# EAGLE board electrobassrev8_fix (EAGLE 9.6.2), part 1 of 2
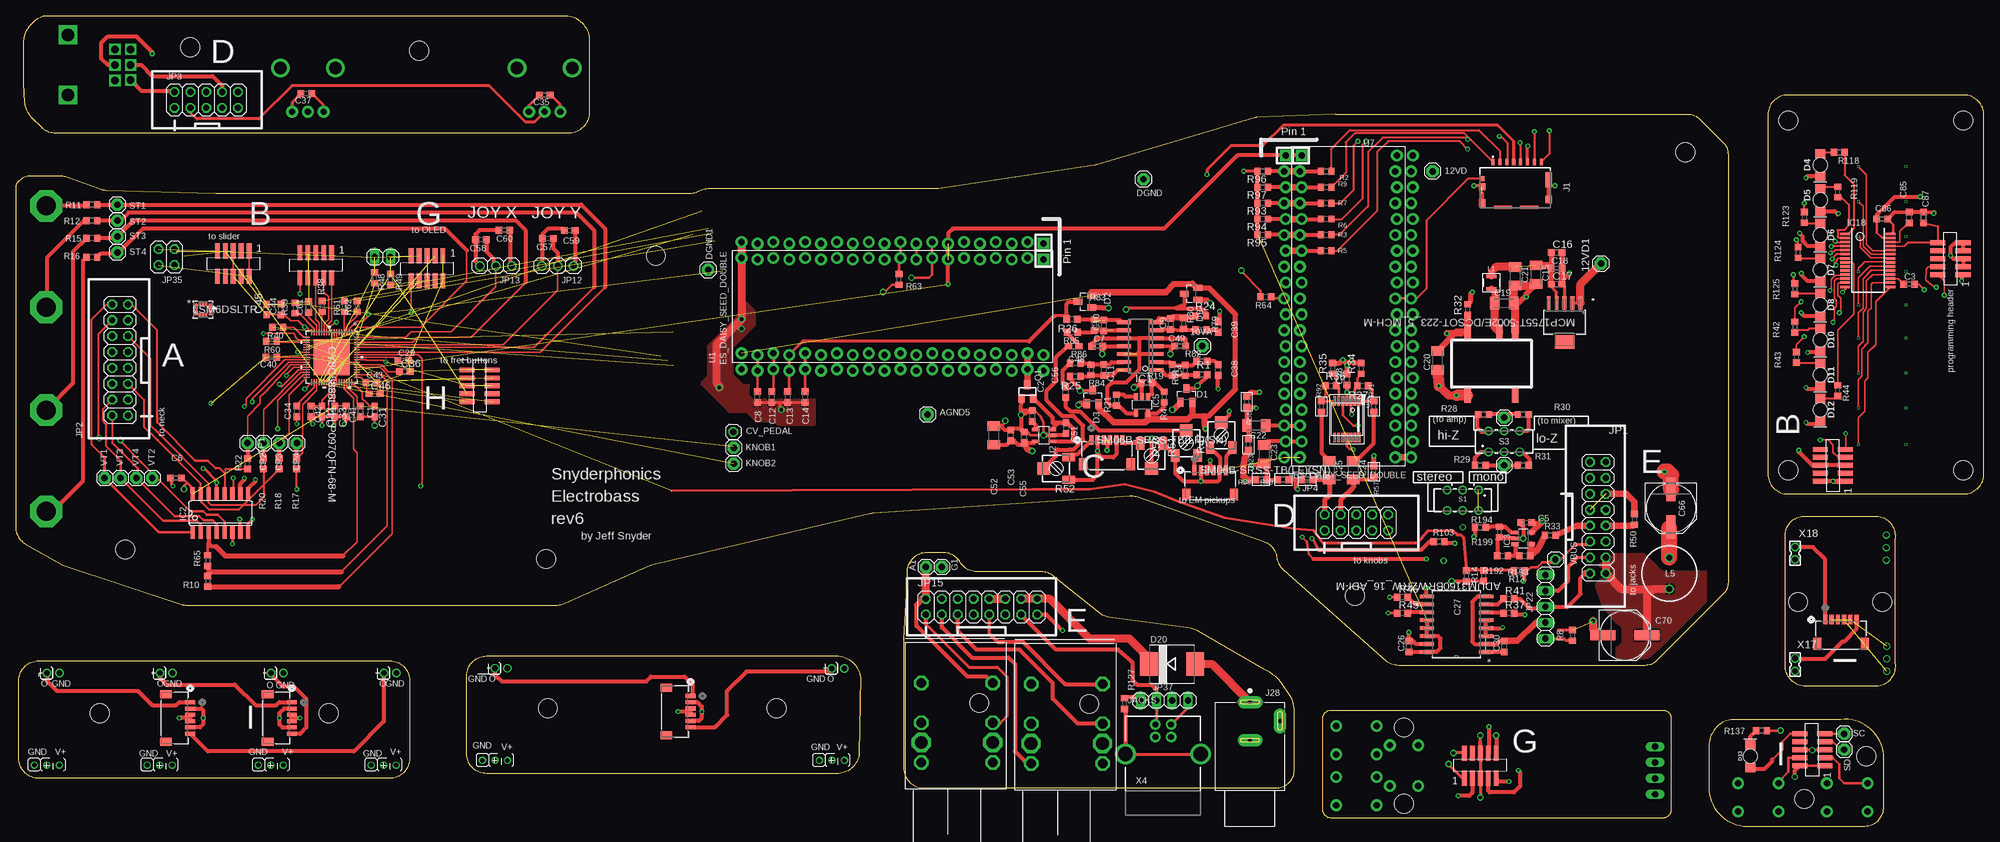
[diagram p11: board, top side]
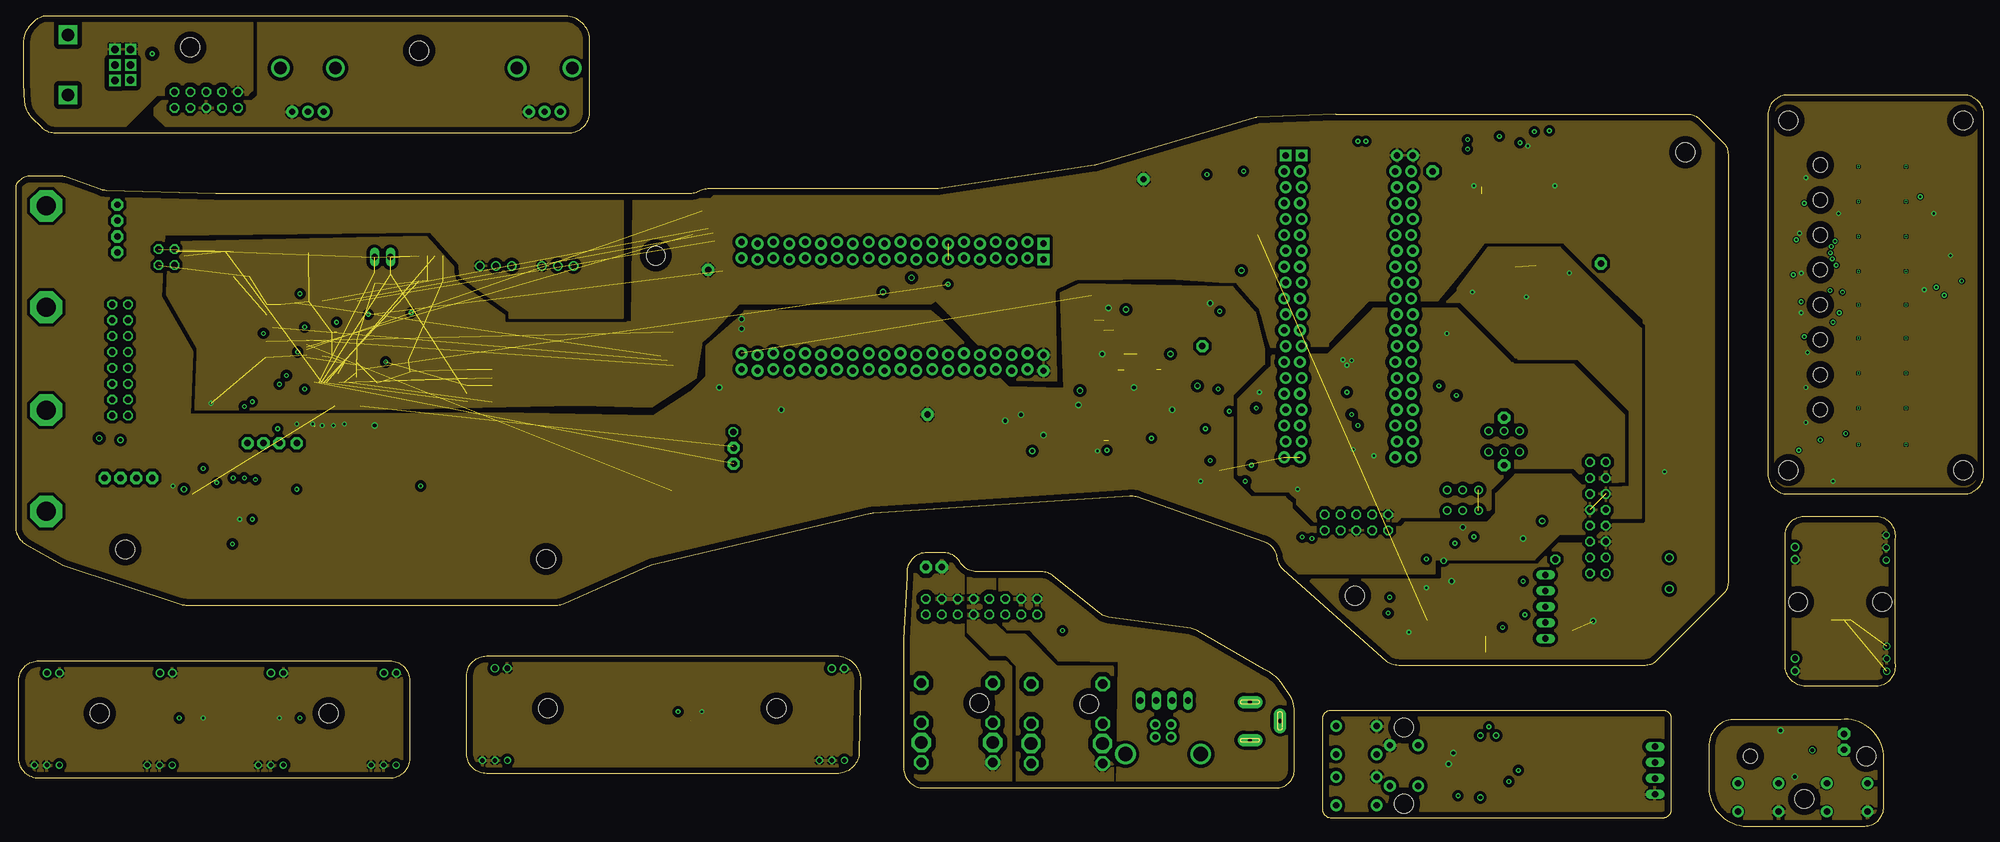
[diagram p12: board, inner layer Route2]
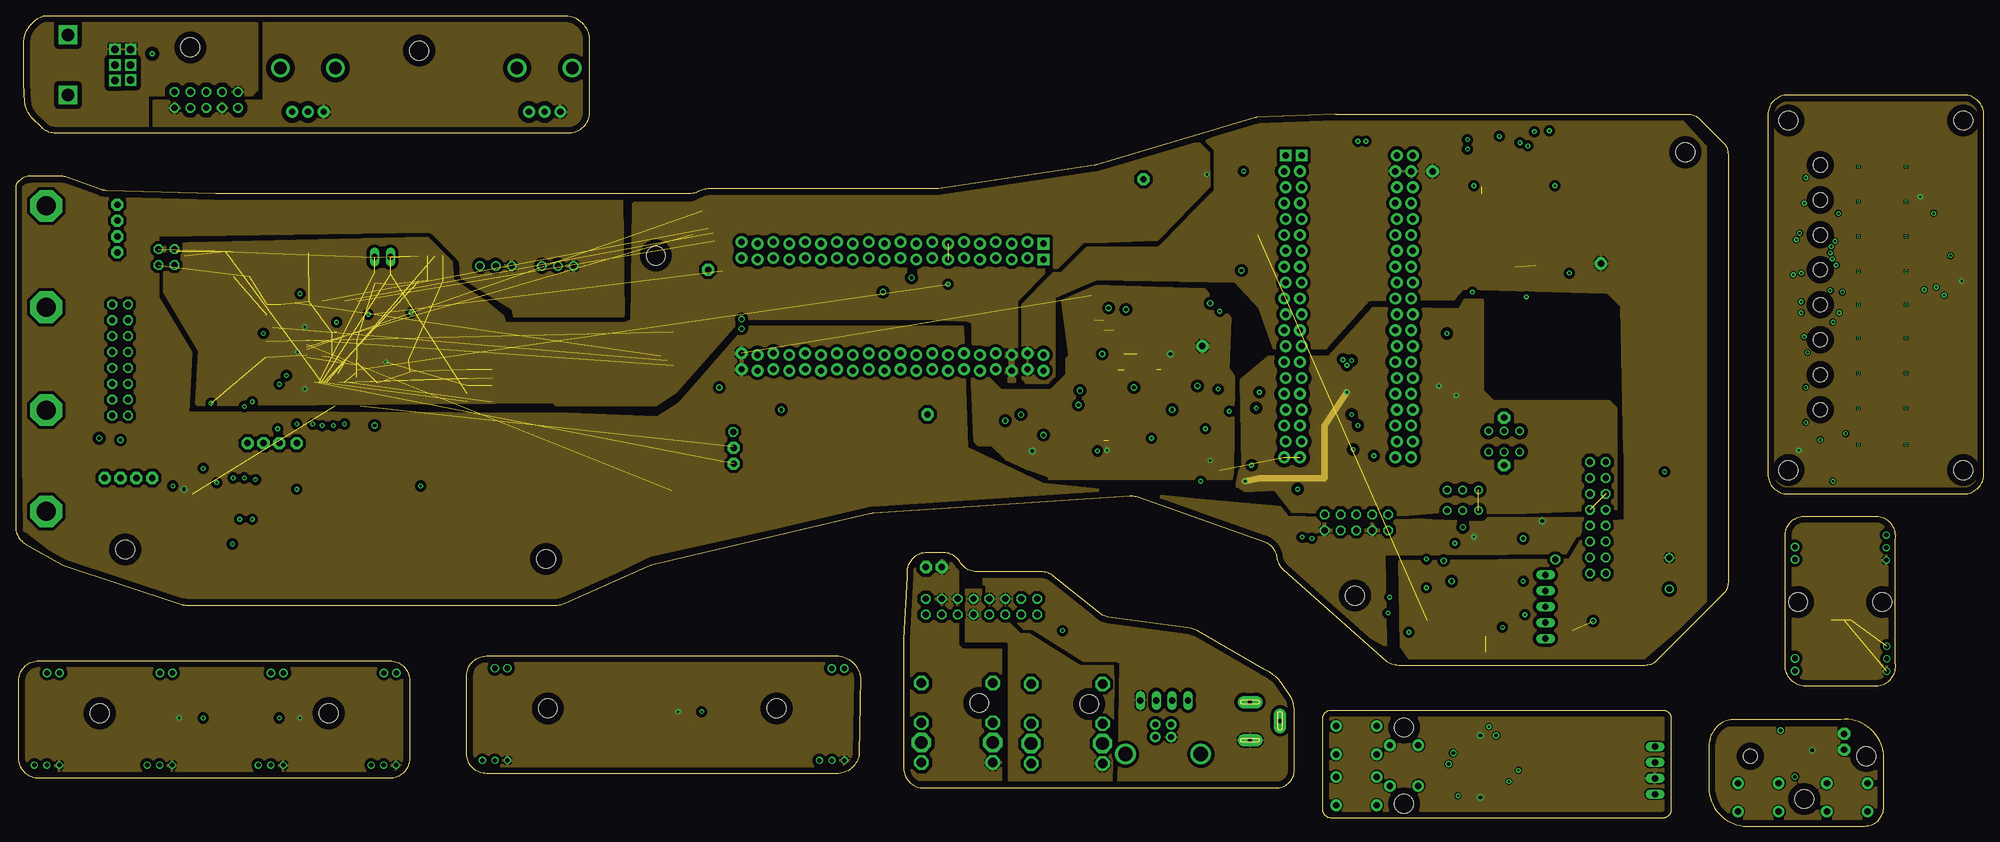
[diagram p13: board, inner layer Route15]
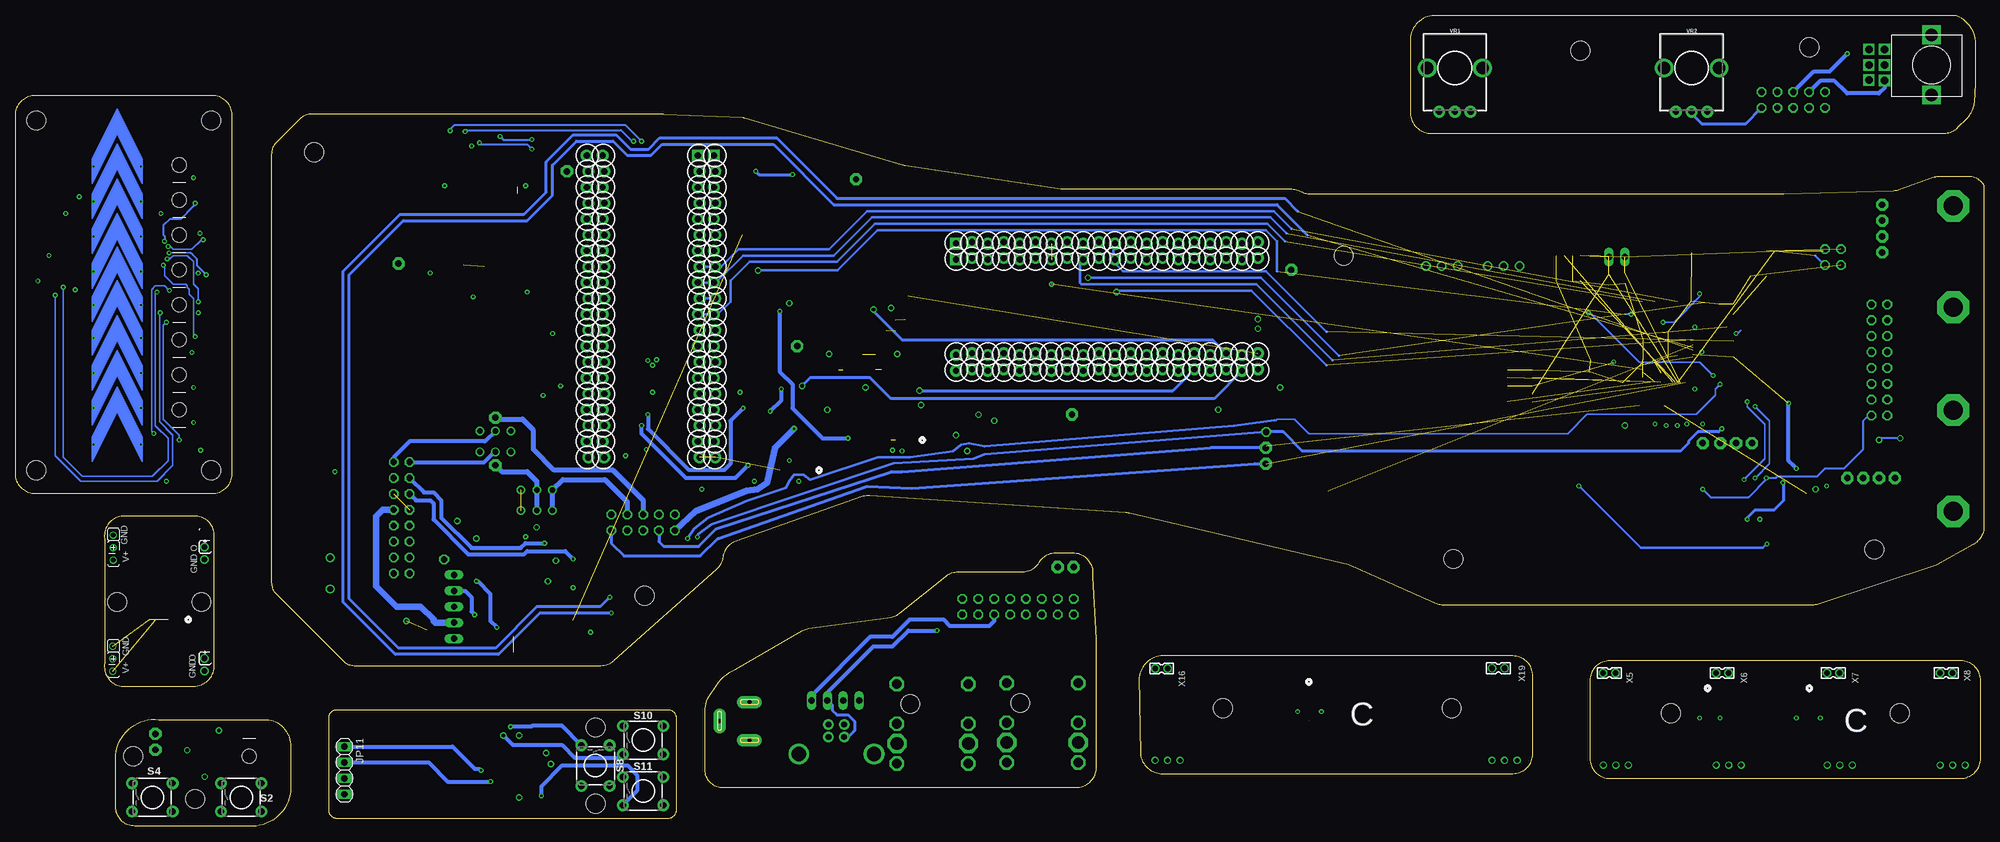
[diagram p14: board, bottom side, seen from below]

Size 314.71 x 129.54 mm. Coordinates in mm from the lower left corner, seen from the top.
Outline: 0,102.36 0,47.82 arc60 1.61,45.06 7.62,41.66 26.44,35.46 arc18 27.43,35.31 86.45,35.31 arc24 87.74,35.58 101.07,41.53 arc-11 101.64,41.73 136.64,49.98 arc-10 137.18,50.05 178.16,52.79 arc-23 179.43,52.62 199.52,45.54 arc-58 201.56,43.26 201.7,42.64 arc35 202.69,40.98 219.06,26.45 arc42 221.17,25.65 260.57,25.65 arc45 262.36,26.4 273.07,37.1 arc45 273.81,38.9 273.81,107.41 arc45 273.07,109.2 269.22,113.05 arc45 267.43,113.79 211.07,113.79 198.37,113.28 arc-9 198.13,113.21 172.93,105.73 arc-8 172.5,105.63 147.55,101.89 arc-9 147.08,101.85 110.89,101.85 arc23 109.64,101.6 109.06,101.35 arc-23 107.81,101.09 32,101.09 14.48,101.59 arc-18 13.49,101.77 8.14,103.7 arc20 7.07,103.89 2.47,103.89 arc63 0,102.36
Outline: 311.53,116.84 283.34,116.84 arc90 280.16,113.66 280.16,56.26 arc90 283.34,53.09 311.53,53.09 arc90 314.71,56.26 314.71,113.66 arc90 311.53,116.84
Outline: 291.85,17.02 275,17.02 arc90 270.76,13.03 270.76,6.78 arc90 276.27,0 295.66,0 arc90 298.7,3.05 298.7,11.43 arc90 291.85,17.02
Outline: 4.62,129.52 88.27,129.54 arc-90 91.69,125.09 91.69,113.92 arc-90 88.27,110.74 6.39,110.74 arc-45 4.15,111.67 2.65,113.17 arc-18 2.06,114 1.81,114.5 arc-22 1.48,115.69 1.27,118.62 1.27,125.03 arc-70 4.38,129.49 4.53,129.53 arc-20 4.62,129.52
Outline: 210.31,18.54 263.4,18.54 arc-90 264.67,17.27 264.67,2.54 arc-90 263.4,1.27 210.31,1.27 arc-90 209.04,2.54 209.04,17.27 arc-90 210.31,18.54
Outline: 142.49,39.88 141.99,29.97 141.99,9.27 arc90 145.16,6.1 201.8,6.1 arc90 204.47,9.27 204.47,18.27 arc28 203.85,20.76 202.63,22.52 arc34 199.56,25.1 188.98,31.21 arc21 187.89,31.57 175.26,33.27 174.75,33.38 arc-27 173.39,34.01 165.97,39.94 arc39 163.99,40.64 153.72,40.64 arc-60 150.97,42.22 arc60 148.41,43.69 145.67,43.69 arc90 142.49,40.51 142.49,39.88
Outline: 130.94,8.38 75.31,8.38 arc-90 72.14,11.56 72.14,24 arc-90 75.31,27.18 130.43,27.18 arc-90 135.13,23.75 134.87,11.56 arc-90 130.94,8.38
Outline: 282.96,26.03 282.96,46.36 arc-90 285.88,49.53 297.81,49.53 arc-90 300.48,45.85 300.48,26.03 arc-90 297.81,22.35 285.88,22.35 arc-90 282.96,26.03
Outline: 59.82,7.62 3.68,7.62 arc-90 0.51,10.79 0.51,23.24 arc-90 3.68,26.42 59.82,26.42 arc-90 62.99,23.24 62.99,10.79 arc-90 59.82,7.62
Copper layers (1+2*15+16): Top 0.035mm / dielectric 1.5mm / Route2 0.035mm / dielectric 0.15mm / Route15 0.035mm / dielectric 0.2mm / Bottom 0.035mm
Design rules "default *": minimum track width 8mil, minimum drill 12mil, track to track 7mil, track to pad 7mil, pad to pad 7mil, via to via 7mil, smd to smd 7mil, copper to edge 40mil, drill to drill 8mil, minimum pad ring 1mil, minimum via ring 8mil, stop-mask expansion 1mil, vias tented up to drill 0mil, thermal gap 10mil
Holes 3.05 mm at 84.84,42.67 17.53,44.2 102.36,91.19 214.12,36.83 266.95,107.7 311.4,112.78 311.4,56.9 283.46,56.9 283.46,112.78 286,4.32 295.91,11.18 64.52,123.95 27.94,124.46 222,15.75 222,3.56 85.09,18.8 121.67,18.8 298.45,35.81 284.99,35.81 13.46,18.03 50.04,18.03

## Footprints (pad centres in the part's own frame; a part is rotated, then mirrored left to right if it is on the bottom)
1X01 = drill 1.016 pad 1.93 octagon: 1 0,0
C0603K = smd 1.05 x 1.08: 1 -0.875,0; 2 0.875,0
C1206K = smd 1.5 x 2: 1 -1.5,0; 2 1.5,0
C0603 = smd 1.1 x 1: 1 -0.85,0; 2 0.85,0
PANASONIC_E = smd 3.8 x 1.4: + 3,0; - -3,0
PANASONIC_F = smd 4 x 1.6: + 3.55,0; - -3.55,0
1X01' = drill 1.016 octagon: 1 0,0
SOT23 = smd 1 x 1.4: 1 -0.95,-1.1; 2 0.95,-1.1; 3 0,1.1
LED-1206-BOTTOM = smd 1.5 x 1.6: A -1.8,0; C 1.8,0 | hole 2.3: 0,0
SMC = smd 2.8 x 3.8: A 3.7,0; C -3.7,0
SO14 = smd 0.6 x 2.2: 1 -3.81,-2.6; 2 -2.54,-2.6; 3 -1.27,-2.6; 4 0,-2.6; 5 1.27,-2.6; 6 2.54,-2.6; 7 3.81,-2.6; 8 3.81,2.6; 9 2.54,2.6; 10 1.27,2.6; 11 0,2.6; 12 -1.27,2.6; 13 -2.54,2.6; 14 -3.81,2.6
SO16 = smd 0.66 x 2.032: 1 -4.445,-3.073; 2 -3.175,-3.073; 3 -1.905,-3.073; 4 -0.635,-3.073; 5 0.635,-3.073; 6 1.905,-3.073; 7 3.175,-3.073; 8 4.445,-3.073; 9 4.445,3.073; 10 3.175,3.073; 11 1.905,3.073; 12 0.635,3.073; 13 -0.635,3.073; 14 -1.905,3.073; 15 -3.175,3.073; 16 -4.445,3.073
SOT23-5 = smd 0.6 x 1.2: 1 -0.95,-1.306; 2 0,-1.306; 3 0.95,-1.306; 4 0.95,1.306; 5 -0.95,1.306
SSOP28 = smd 0.4 x 1.5: 1 -4.225,-3.625; 2 -3.575,-3.625; 3 -2.925,-3.625; 4 -2.275,-3.625; 5 -1.625,-3.625; 6 -0.975,-3.625; 7 -0.325,-3.625; 8 0.325,-3.625; 9 0.975,-3.625; 10 1.625,-3.625; 11 2.275,-3.625; 12 2.925,-3.625; 13 3.575,-3.625; 14 4.225,-3.625; 15 4.225,3.625; 16 3.575,3.625; 17 2.925,3.625; 18 2.275,3.625; 19 1.625,3.625; 20 0.975,3.625; 21 0.325,3.625; 22 -0.325,3.625; 23 -0.975,3.625; 24 -1.625,3.625; 25 -2.275,3.625; 26 -2.925,3.625; 27 -3.575,3.625; 28 -4.225,3.625
105162-0001 = smd 0.5 x 1: 1 3.55,-7.34; 2 2.45,-7.34; 3 1.35,-7.34; 4 0.25,-7.34; 5 -0.85,-7.34; 6 -1.95,-7.34; 7 -3.05,-7.34; 8 -4.15,-7.34 | smd 0.72 x 0.78: 9 5.31,-4.66 | smd 1.05 x 1.08: 10 5.325,-3.39 | smd 1.05 x 1.2: 11 5.325,-0.78; 12 -5.325,-1.35 | smd 1.05 x 2.39: 13 -5.325,-4.535 | smd 2.91 x 0.55: 14 1.986,-0.105; 15 -2.204,-0.105
CONN_SM06B-SRSS-TB_JST = smd 0.66 x 1.549: 1 -2.5,2.507; 2 -1.5,2.507; 3 -0.5,2.507; 4 0.5,2.507; 5 1.5,2.507; 6 2.5,2.507 | smd 1.295 x 1.905: 7 -3.8,-1.368; 8 3.8,-1.368
CUI_PJ-066A = drill 0.7 pad 2 long: 1 0,0; 2 6.1,0; 3 3,4.8
2X08 = drill 1.016 octagon: 1 -8.89,-1.27; 2 -8.89,1.27; 3 -6.35,-1.27; 4 -6.35,1.27; 5 -3.81,-1.27; 6 -3.81,1.27; 7 -1.27,-1.27; 8 -1.27,1.27; 9 1.27,-1.27; 10 1.27,1.27; 11 3.81,-1.27; 12 3.81,1.27; 13 6.35,-1.27; 14 6.35,1.27; 15 8.89,-1.27; 16 8.89,1.27
2X05 = drill 1.016 octagon: 1 -5.08,-1.27; 2 -5.08,1.27; 3 -2.54,-1.27; 4 -2.54,1.27; 5 0,-1.27; 6 0,1.27; 7 2.54,-1.27; 8 2.54,1.27; 9 5.08,-1.27; 10 5.08,1.27
20021121 = smd 0.76 x 2.4: 1 -2.54,-2; 2 -2.54,2; 3 -1.27,-2; 4 -1.27,2; 5 0,-2; 6 0,2; 7 1.27,-2; 8 1.27,2; 9 2.54,-2; 10 2.54,2
1X04 = drill 1.016 long: 1 -3.81,0; 2 -1.27,0; 3 1.27,0; 4 3.81,0
1X03 = drill 1.016: 1 -2.54,0; 2 0,0; 3 2.54,0
1X05 = drill 1.016 long: 1 -5.08,0; 2 -2.54,0; 3 0,0; 4 2.54,0; 5 5.08,0
1X02 = drill 1.016 long: 1 -1.27,0; 2 1.27,0
2X02 = drill 1.016 octagon: 1 -1.27,-1.27; 2 -1.27,1.27; 3 1.27,-1.27; 4 1.27,1.27
BOURNS_SRP2010 = smd 0.559 x 1.6: P$1 -1.003,0; P$2 1.003,0
6000-XXXX-RC = drill 0.9 pad 1.422: 1 -2.5,0; 2 2.5,0
SUPER-SOT3 = smd 1 x 1.4: 1 -0.95,-1.1; 2 0.95,-1.1; 3 0,1.1
R0603 = smd 1 x 1.1: 1 -0.85,0; 2 0.85,0
RTRIM3314J = smd 1.3 x 2: 1 1.8,-2; 3 -1.8,-2 | smd 2 x 2: 2 0,2
452404020202 = drill 0.9: 1 2.5,1.65; 2 0,1.65; 3 -2.5,1.65; 4 2.5,-1.65; 5 0,-1.65; 6 -2.5,-1.65
TACTILE_SWITCH_PTH_6.0MM = drill 1.016 pad 1.88: 1 -3.251,2.261; 2 3.251,2.261; 3 -3.251,-2.261; 4 3.251,-2.261
ES_DAISY_SEED_DOUBLE = drill 1.016 pad 1.88 square: 1 -7.493,24.13; B1 -10.033,24.13 | drill 1.016 pad 1.88: 2 -7.747,21.59; 3 -7.493,19.05; 4 -7.747,16.51; 5 -7.493,13.97; 6 -7.747,11.43; 7 -7.493,8.89; 8 -7.747,6.35; 9 -7.493,3.81; 10 -7.747,1.27; 11 -7.493,-1.27; 12 -7.747,-3.81; 13 -7.493,-6.35; 14 -7.747,-8.89; 15 -7.493,-11.43; 16 -7.747,-13.97; 17 -7.493,-16.51; 18 -7.747,-19.05; 19 -7.493,-21.59; 20 -7.747,-24.13; 21 7.493,-24.13; 22 7.747,-21.59; 23 7.493,-19.05; 24 7.747,-16.51; 25 7.493,-13.97; 26 7.747,-11.43; 27 7.493,-8.89; 28 7.747,-6.35; 29 7.493,-3.81; 30 7.747,-1.27; 31 7.493,1.27; 32 7.747,3.81; 33 7.493,6.35; 34 7.747,8.89; 35 7.493,11.43; 36 7.747,13.97; 37 7.493,16.51; 38 7.747,19.05; 39 7.493,21.59; 40 7.747,24.13; B2 -10.287,21.59; B3 -10.033,19.05; B4 -10.287,16.51; B5 -10.033,13.97; B6 -10.287,11.43; B7 -10.033,8.89; B8 -10.287,6.35; B9 -10.033,3.81; B10 -10.287,1.27; B11 -10.033,-1.27; B12 -10.287,-3.81; B13 -10.033,-6.35; B14 -10.287,-8.89; B15 -10.033,-11.43; B16 -10.287,-13.97; B17 -10.033,-16.51; B18 -10.287,-19.05; B19 -10.033,-21.59; B20 -10.287,-24.13; B21 10.033,-24.13; B22 10.287,-21.59; B23 10.033,-19.05; B24 10.287,-16.51; B25 10.033,-13.97; B26 10.287,-11.43; B27 10.033,-8.89; B28 10.287,-6.35; B29 10.033,-3.81; B30 10.287,-1.27; B31 10.033,1.27; B32 10.287,3.81; B33 10.033,6.35; B34 10.287,8.89; B35 10.033,11.43; B36 10.287,13.97; B37 10.033,16.51; B38 10.287,19.05; B39 10.033,21.59; B40 10.287,24.13
SOT25 = smd 0.55 x 1.2: 1 -0.95,-1.3; 2 0,-1.3; 3 0.95,-1.3; 4 0.95,1.3; 5 -0.95,1.3
SOT-223_5_MCH-M = smd 0.61 x 2.159: 1 -2.54,-3.109; 2 -1.27,-3.109; 3 0,-3.109; 4 1.27,-3.109; 5 2.54,-3.109 | smd 3.15 x 2.159: 6 0,3.109
QFN-68-M = smd 0.914 x 0.203: 1 -4,3.2; 2 -4,2.8; 3 -4,2.4; 4 -4,2; 5 -4,1.6; 6 -4,1.2; 7 -4,0.8; 8 -4,0.4; 9 -4,0; 10 -4,-0.4; 11 -4,-0.8; 12 -4,-1.2; 13 -4,-1.6; 14 -4,-2; 15 -4,-2.4; 16 -4,-2.8; 17 -4,-3.2; 35 4,-3.2; 36 4,-2.8; 37 4,-2.4; 38 4,-2; 39 4,-1.6; 40 4,-1.2; 41 4,-0.8; 42 4,-0.4; 43 4,0; 44 4,0.4; 45 4,0.8; 46 4,1.2; 47 4,1.6; 48 4,2; 49 4,2.4; 50 4,2.8; 51 4,3.2 | smd 0.203 x 0.914: 18 -3.2,-4; 19 -2.8,-4; 20 -2.4,-4; 21 -2,-4; 22 -1.6,-4; 23 -1.2,-4; 24 -0.8,-4; 25 -0.4,-4; 26 0,-4; 27 0.4,-4; 28 0.8,-4; 29 1.2,-4; 30 1.6,-4; 31 2,-4; 32 2.4,-4; 33 2.8,-4; 34 3.2,-4; 52 3.2,4; 53 2.8,4; 54 2.4,4; 55 2,4; 56 1.6,4; 57 1.2,4; 58 0.8,4; 59 0.4,4; 60 0,4; 61 -0.4,4; 62 -0.8,4; 63 -1.2,4; 64 -1.6,4; 65 -2,4; 66 -2.4,4; 67 -2.8,4; 68 -3.2,4 | smd 5.791 x 5.791: 69 0,0
RW_16_ADI-M = smd 2.286 x 0.559: 1 -4.737,4.445; 2 -4.737,3.175; 3 -4.737,1.905; 4 -4.737,0.635; 5 -4.737,-0.635; 6 -4.737,-1.905; 7 -4.737,-3.175; 8 -4.737,-4.445; 9 4.737,-4.445; 10 4.737,-3.175; 11 4.737,-1.905; 12 4.737,-0.635; 13 4.737,0.635; 14 4.737,1.905; 15 4.737,3.175; 16 4.737,4.445
QFN_6DSLTR_STM = smd 0.584 x 0.356: 1 -1.156,0.75; 2 -1.156,0.25; 3 -1.156,-0.25; 4 -1.156,-0.75; 8 1.156,-0.75; 9 1.156,-0.25; 10 1.156,0.25; 11 1.156,0.75 | smd 0.356 x 0.584: 5 -0.5,-0.914; 6 0,-0.914; 7 0.5,-0.914; 12 0.5,0.914; 13 0,0.914; 14 -0.5,0.914
TSSOP-14 = smd 0.45 x 1.5: 1 -1.95,-2.9; 2 -1.3,-2.9; 3 -0.65,-2.9; 4 0,-2.9; 5 0.65,-2.9; 6 1.3,-2.9; 7 1.95,-2.9; 8 1.95,2.9; 9 1.3,2.9; 10 0.65,2.9; 11 0,2.9; 12 -0.65,2.9; 13 -1.3,2.9; 14 -1.95,2.9
SLIDERS_SLIDER-SEGMENT3 = drill 0.254 pad 0.406 square: P$1 -1.27,3.81; P$2 -1.27,-3.81
PN092 = drill 2 square: P$1 -4.8,0; P$2 4.8,0 | drill 1.2 square: P$3 -2.5,-7.5; P$4 0,-7.5; P$5 2.5,-7.5; P$6 -2.5,-10; P$7 0,-10; P$8 2.4,-10
XP_POWER_ISEXXXXA = smd 1 x 2.28: P$1 -3.81,-5.08; P$2 -1.27,-5.08; P$4 3.81,-5.08; P$5 3.81,5.08; P$8 -3.81,5.08
STRING_HOLDER = drill 3.048 pad 5.08 octagon: P$1 0,0
POT-PTH-ALPS-KIT = drill 1 pad 1.88: P$1 7,-2.5; P$2 7,0; P$3 7,2.5 | drill 2: P$4 0,-4.4; P$5 0,4.4
3P-2MM-TH = drill 0.75: P$1 -2,0; P$2 0,0; P$3 2,0
NRJ6HF2 = drill 2.057 octagon: POST1 -7.442,0; POST2 -7.442,-11.43 | drill 1.524 octagon: R -10.6,0; RN -10.6,-11.43; S -4.25,0; SN -4.25,-11.43; T -16.942,0; TN -16.942,-11.43 | hole 2.997: -13.792,-2.134
USB-B-PTH = drill 0.914 pad 1.676: D+ 0,1.25; D- 1.981,1.25; GND 0,-1.25; VBUS 1.981,-1.25 | drill 2.286: S1 -2.718,-6.02; S2 -2.718,6.02
332-02 = drill 0.9 pad 1.27: 1 0,-1; 2 0,1

## Placement (x,y rotation side)
10VA  [1X01]  189.74,76.71 90 top
12VD  [1X01]  226.57,104.65 270 top
12VD1  [1X01]  253.49,89.92 90 top
A1  [1X01]  145.54,41.4 0 top
AGND5  [1X01]  145.8,65.79 0 top
AUDIO_OUT_L_POSTVOL  [1X01]  238,65.28 0 top
AUDIO_OUT_R_POSTVOL  [1X01]  238,57.66 0 top
C1  .01uf  [C0603K]  55.12,66.29 270 top
C2  .01uf  [C0603K]  162.56,65.53 90 top
C3  2200pf  [C0603K]  302.77,86.61 0 top
C4  560pf  [C0603K]  184.91,72.9 270 top
C5  .1uf  [C0603K]  241.55,48.51 180 top
C6  .1uf  [C0603K]  25.65,55.63 180 top
C7  .1uf  [C0603K]  172.97,76.71 0 top
C8  .01uf  [C0603K]  118.62,68.58 270 top
C9  560pf  [C0603K]  184.66,80.26 90 top
C10  560pf  [C0603K]  173.99,80.01 90 top
C11  560pf  [C0603K]  173.99,72.9 270 top
C12  .01uf  [C0603K]  120.9,68.58 270 top
C13  .01uf  [C0603K]  123.44,68.58 270 top
C14  .01uf  [C0603K]  126.24,68.58 270 top
C15  10uf  [C1206K]  243.08,88.14 270 top
C16  1uf  [C0603]  246.38,91.69 0 top
C17  .001uf  [C0603]  246.38,86.61 0 top
C18  .01uf  [C0603K]  246.38,89.15 0 top
C19  10uf  [C1206K]  238,83.57 0 top
C20  10uf  [C1206K]  227.33,74.42 90 top
C21  10uf  [C1206K]  239.78,87.88 270 top
C22  10uf  [C1206K]  198.37,64.01 180 top
C23  10uf  [C1206K]  199.64,59.44 270 top
C24  10uf  [C1206K]  213.87,56.9 270 top
C25  10uf  [C1206K]  210.06,56.9 270 top
C26  .1uf  [C0603K]  222.76,28.7 90 top
C27  .1uf  [C0603K]  231.96,39.99 270 top
C28  .1uf  [C0603K]  212.85,71.37 90 top
C29  2200pf  [C0603K]  61.98,74.42 0 top
C30  .1uf  [C0603K]  238,28.7 90 top
C31  1uf  [C0603]  57.4,66.29 270 top
C32  1uf  [C0603]  49.02,66.29 270 top
C33  1uf  [C0603]  51.05,66.29 270 top
C34  .01uf  [C0603K]  44.96,66.29 270 top
C35  .1uf  [C0603K]  84.58,116.84 180 top
C36  1uf  [C0603]  62.23,72.64 0 top
C37  .1uf  [C0603K]  46.48,117.09 180 top
C38  1uf  [C0603]  192.28,72.9 90 top
C39  1uf  [C0603]  192.28,79.76 270 top
C40  .1uf  [C0603K]  40.89,74.93 180 top
C41  .1uf  [C0603K]  52.83,66.29 270 top
C42  .1uf  [C0603K]  47.24,66.29 270 top
C43  .1uf  [C0603K]  56.9,70.87 0 top
C44  .1uf  [C0603K]  42.42,82.55 90 top
C45  1uf  [C0603]  40.13,82.55 90 top
C46  1uf  [C0603]  57.4,69.09 0 top
C48  1uf  [C0603]  169.16,76.71 0 top
C49  .1uf  [C0603K]  186.21,76.74 0 top
C51  1uf  [C0603]  167.93,63.6 270 top
C52  10uf  [C1206K]  156.37,62.45 90 top
C53  1uf  [C0603]  159.1,62.45 90 top
C55  .001uf  [C0603]  161.26,62.13 90 top
C56  1uf  [C0603]  167.89,69.34 90 top
C57  .01uf  [C0603K]  85.09,93.92 180 top
C58  .01uf  [C0603K]  74.42,93.73 180 top
C59  .1uf  [C0603K]  88.58,95.19 180 top
C60  .1uf  [C0603K]  78.17,95.25 180 top
C61  2200pf  [C0603K]  46.84,82.98 90 top
C66  47uf  [PANASONIC_E]  264.67,50.8 270 top
C70  100uf  [PANASONIC_F]  257.3,30.48 0 top
C85  .1uf  [C0603K]  302.77,97.28 90 top
C86  .1uf  [C0603K]  298.45,97.03 0 top
C87  .1uf  [C0603K]  305.05,97.28 90 top
CP1  [1X01]  37.08,61.21 0 top
CP2  [1X01]  39.62,61.21 0 top
CP3  [1X01]  42.16,61.21 0 top
CP4  [1X01]  44.96,61.21 0 top
CV_PEDAL  [1X01']  114.74,62.99 0 top
D1  BAT54S  [SOT23]  187.2,68.83 0 top
D2  BAT54S  [SOT23]  170.94,83.82 90 top
D3  BAT54S  [SOT23]  172.21,68.58 0 top
D4  [LED-1206-BOTTOM]  288.54,105.66 270 top
D5  [LED-1206-BOTTOM]  288.54,100.08 270 top
D6  [LED-1206-BOTTOM]  288.54,94.49 270 top
D7  [LED-1206-BOTTOM]  288.54,88.9 270 top
D8  [LED-1206-BOTTOM]  288.54,83.31 270 top
D9  BAT54S  [SOT23]  187.96,85.09 90 top
D10  [LED-1206-BOTTOM]  288.54,77.72 270 top
D11  [LED-1206-BOTTOM]  288.54,72.14 270 top
D12  [LED-1206-BOTTOM]  288.54,66.55 270 top
D13  [LED-1206-BOTTOM]  277.37,11.18 90 top
D20  MBRS340T3  [SMC]  184.91,25.91 0 top
DGND  [1X01]  180.34,103.38 270 top
DGND1  [1X01]  110.74,88.9 90 top
G1  [1X01]  148.08,41.4 0 top
IC1  LMV324M  [SO14]  179.83,76.71 90 top
IC2  4052D  [SO16]  32.77,50.04 0 top
IC3  LMV321M5  [SOT23-5]  241.05,45.97 270 top
IC5  LMV321M5  [SOT23-5]  180.09,67.31 180 top
IC18  CY8C4124  [SSOP28]  296.16,90.42 270 top
J1  105162-0001  [105162-0001]  239.78,98.81 180 top
J2  SM06B-SRSS-TB(LF)(SN)  [CONN_SM06B-SRSS-TB_JST]  174.5,59.18 0 top
J3  SM06B-SRSS-TB(LF)(SN)  [CONN_SM06B-SRSS-TB_JST]  191.01,54.36 0 top
J5  SM06B-SRSS-TB(LF)(SN)  [CONN_SM06B-SRSS-TB_JST]  291.85,30.48 0 top
J6  SM06B-SRSS-TB(LF)(SN)  [CONN_SM06B-SRSS-TB_JST]  105.41,18.29 270 top
J7  SM06B-SRSS-TB(LF)(SN)  [CONN_SM06B-SRSS-TB_JST]  25.4,17.27 270 top
J8  SM06B-SRSS-TB(LF)(SN)  [CONN_SM06B-SRSS-TB_JST]  41.66,17.27 270 top
J28  PJ-066A  [CUI_PJ-066A]  197.36,19.81 270 top
JP1  [2X08]  252.98,49.28 270 top
JP2  [2X08]  16.71,74.5 90 top
JP3  PINHD-2X5  [2X05]  30.48,116.08 0 top
JP4  PINHD-2X5  [2X05]  214.38,48.51 0 top
JP5  20021121  [20021121]  48.01,89.66 180 top
JP6  20021121  [20021121]  290.58,57.66 90 top
JP8  20021121  [20021121]  34.8,89.92 180 top
JP9  20021121  [20021121]  65.79,89.15 180 top
JP10  20021121  [20021121]  234.19,9.65 0 top
JP11  PINHD-1X4  [1X04]  262.13,8.89 270 bottom
JP12  [1X03]  86.68,89.53 180 top
JP13  [1X03]  76.77,89.53 180 top
JP15  [2X08]  154.43,35.05 0 top
JP22  PINHD-1X5  [1X05]  244.6,35.05 270 top
JP23  20021121  [20021121]  74.17,70.36 270 top
JP24  20021121  [20021121]  287.27,12.19 90 top
JP31  [1X02]  58.67,90.93 0 top
JP34  20021121  [20021121]  309.37,90.68 90 top
JP35  [2X02]  24.13,90.93 180 top
JP37  [1X04]  183.64,20.07 0 top
KNOB1  [1X01]  114.81,60.45 0 top
KNOB2  [1X01]  114.81,57.91 0 top
L1  2.2uH  [BOURNS_SRP2010]  235.97,86.87 270 top
L5  [6000-XXXX-RC]  264.41,40.39 90 top
Q1  DMP3099L  [SUPER-SOT3]  161.77,69.44 0 top
R1  10k  [R0603]  189.69,72.16 0 top
R2  47R  [R0603]  209.55,104.65 0 top
R3  47R  [R0603]  209.55,94.49 0 top
R4  10k  [R0603]  183.64,68.58 90 top
R5  47R  [R0603]  209.55,91.95 0 top
R6  47R  [R0603]  209.55,97.03 0 top
R7  47R  [R0603]  209.55,99.57 0 top
R8  0R  [R0603]  248.92,30.48 90 top
R9  47R  [R0603]  209.55,102.11 0 top
R10  0R  [R0603]  30.73,39.12 90 top
R11  0R  [R0603]  12.19,99.31 180 top
R12  0R  [R0603]  12.19,96.77 180 top
R13  33k  [R0603]  240.41,40.83 0 top
R14  68k  [R0603]  234.73,40.01 90 top
R15  0R  [R0603]  12.19,93.98 180 top
R16  0R  [R0603]  12.19,90.93 180 top
R17  0R  [R0603]  44.96,57.91 90 top
R18  0R  [R0603]  42.16,57.91 90 top
R19  10k  [R0603]  180.85,70.87 180 top
R20  0R  [R0603]  39.62,57.91 90 top
R21  1.6k  [R0603]  176.02,68.07 90 top
R22  0R  [R0603]  37.08,57.91 90 top
R23  2M  [R0603]  197.1,60.96 270 top
R24  10k  [R0603]  189.48,81.53 0 top
R25  10k  [R0603]  169.42,71.88 180 top
R26  10k  [R0603]  168.91,81.03 180 top
R27  20k  [R0603]  215.39,70.36 180 top
R28  10k  [R0603]  234.7,65.79 180 top
R29  10k  [R0603]  234.19,57.66 180 top
R30  47R  [R0603]  241.05,65.79 0 top
R31  47R  [R0603]  241.05,57.66 0 top
R32  5R_DNP  [R0603]  232.16,82.55 90 top
R33  47R  [R0603]  245.36,46.48 0 top
R34  10k  [R0603]  215.14,73.15 90 top
R35  10k  [R0603]  210.57,73.15 90 top
R36  20k  [R0603]  210.31,70.36 0 top
R37  22R  [R0603]  238.76,34.04 0 top
R38  47R  [R0603]  49.02,83.06 90 top
R39  47R  [R0603]  44.7,82.8 90 top
R40  47R  [R0603]  41.91,79.76 180 top
R41  22R  [R0603]  238.76,36.32 0 top
R42  82R  [R0603]  284.48,79.76 270 top
R43  82R  [R0603]  284.73,74.93 270 top
R44  82R  [R0603]  291.34,69.6 270 top
R45  22R  [R0603]  221.74,34.04 0 top
R46  22R  [R0603]  221.74,36.58 0 top
R47  [RTRIM3314J]  192.79,62.48 0 top
R48  1.6k  [R0603]  57.4,87.63 270 top
R49  1.6k  [R0603]  59.94,87.38 270 top
R50  5R  [R0603]  258.83,49.02 90 top
R51  [RTRIM3314J]  181.61,59.18 180 top
R52  [RTRIM3314J]  166.37,57.15 90 top
R53  [RTRIM3314J]  187.2,61.21 0 top
R56  2M  [R0603]  196.85,67.82 270 top
R57  2M  [R0603]  217.17,56.64 270 top
R60  47R  [R0603]  40.89,77.47 180 top
R61  47R  [R0603]  52.58,83.06 90 top
R62  47R  [R0603]  54.61,83.06 90 top
R63  47R  [R0603]  141.22,87.38 270 top
R64  47R  [R0603]  199.9,84.58 180 top
R65  1.6k  [R0603]  30.73,42.42 90 top
R79  10k  [R0603]  189.55,79.31 180 top
R80  10k  [R0603]  186.75,80.33 90 top
R81  10k  [R0603]  187.01,72.83 270 top
R82  10k  [R0603]  189.67,74.29 0 top
R83  10k  [R0603]  172.47,80.07 90 top
R84  10k  [R0603]  171.96,72.9 270 top
R85  10k  [R0603]  168.97,78.93 180 top
R86  10k  [R0603]  169.42,73.98 180 top
R88  2M  [R0603]  199.14,55.37 180 top
R89  2M  [R0603]  202.69,55.37 180 top
R90  2M  [R0603]  206.5,55.37 0 top
R91  100R  [R0603]  217.17,67.06 90 top
R92  100R  [R0603]  208.79,67.06 90 top
R93  47k  [R0603]  199.39,99.57 180 top
R94  47k  [R0603]  199.39,97.03 180 top
R95  47k  [R0603]  199.39,94.49 180 top
R96  47k  [R0603]  199.39,104.65 180 top
R97  47k  [R0603]  199.39,102.11 180 top
R103  0R  [R0603]  227.58,45.47 180 top
R118  82R  [R0603]  291.59,107.7 180 top
R119  82R  [R0603]  291.34,101.35 90 top
R123  82R  [R0603]  286,97.28 270 top
R124  82R  [R0603]  284.99,91.69 270 top
R125  82R  [R0603]  284.48,85.85 270 top
R127  0R  [R0603]  177.29,19.56 90 top
R137  560R  [R0603]  279.15,15.24 0 top
R192  10k  [R0603]  237.74,43.18 0 top
R193  10k  [R0603]  241.3,43.18 180 top
R194  10k  [R0603]  234.19,47.75 180 top
R199  10k  [R0603]  237.24,46.99 90 top
S1  [452404020202]  231.39,52.07 0 top
S2  MOMENTARY-SWITCH-SPST-PTH-6.0MM  [TACTILE_SWITCH_PTH_6.0MM]  278.64,4.57 0 bottom
S3  [452404020202]  238,61.47 180 top
S4  MOMENTARY-SWITCH-SPST-PTH-6.0MM  [TACTILE_SWITCH_PTH_6.0MM]  292.86,4.57 0 bottom
S8  MOMENTARY-SWITCH-SPST-PTH-6.0MM  [TACTILE_SWITCH_PTH_6.0MM]  222,9.65 270 bottom
S10  MOMENTARY-SWITCH-SPST-PTH-6.0MM  [TACTILE_SWITCH_PTH_6.0MM]  214.38,13.72 0 bottom
S11  MOMENTARY-SWITCH-SPST-PTH-6.0MM  [TACTILE_SWITCH_PTH_6.0MM]  214.38,5.59 0 bottom
SC  [1X01]  292.35,14.73 0 top
SD  [1X01]  292.35,12.19 0 top
ST1  [1X01]  16.26,99.31 0 top
ST2  [1X01]  16.26,96.77 0 top
ST3  [1X01]  16.26,94.23 0 top
ST4  [1X01]  16.26,91.69 0 top
U1  ES_DAISY_SEED_DOUBLE  [ES_DAISY_SEED_DOUBLE]  140.21,83.06 270 top
U2  LP2985  [SOT25]  164.43,62.45 90 top
U3  MCP1755T-5002E/DCSOT-223_5_MCH-M  [SOT-223_5_MCH-M]  247.65,80.52 180 top
U4  CY8C5888LTI-LP097QFN-68-M  [QFN-68-M]  50.55,74.93 270 top
U5  ADUM3160BRWZRW_16_ADI-M  [RW_16_ADI-M]  230.38,32.26 180 top
U6  LSM6DSLTR  [QFN_6DSLTR_STM]  29.97,82.55 0 top
U7  ES_DAISY_SEED_DOUBLE  [ES_DAISY_SEED_DOUBLE]  213.11,83.06 0 top
U10  OPA1654  [TSSOP-14]  212.85,65.02 180 top
U$1  SLIDER_SEGMENT  [SLIDERS_SLIDER-SEGMENT3]  298.45,106.68 90 bottom
U$2  PN092  [PN092]  8.38,121.67 270 bottom
U$5  SLIDER_SEGMENT  [SLIDERS_SLIDER-SEGMENT3]  298.45,101.09 90 bottom
U$9  POWER_ISOLATE  [XP_POWER_ISEXXXXA]  235.97,73.91 180 top
U$11  SLIDER_SEGMENT  [SLIDERS_SLIDER-SEGMENT3]  298.45,95.5 90 bottom
U$12  SLIDER_SEGMENT  [SLIDERS_SLIDER-SEGMENT3]  298.45,89.92 90 bottom
U$13  SLIDER_SEGMENT  [SLIDERS_SLIDER-SEGMENT3]  298.45,84.58 90 bottom
U$14  SLIDER_SEGMENT  [SLIDERS_SLIDER-SEGMENT3]  298.45,79.25 90 bottom
U$15  STRING_HOLDER  [STRING_HOLDER]  4.89,82.93 0 top
U$16  STRING_HOLDER  [STRING_HOLDER]  4.89,99.12 0 top
U$18  SLIDER_SEGMENT  [SLIDERS_SLIDER-SEGMENT3]  298.45,73.66 90 bottom
U$19  SLIDER_SEGMENT  [SLIDERS_SLIDER-SEGMENT3]  298.45,68.07 90 bottom
U$20  SLIDER_SEGMENT  [SLIDERS_SLIDER-SEGMENT3]  298.45,62.23 90 bottom
U$68  STRING_HOLDER  [STRING_HOLDER]  4.89,66.48 0 top
U$69  STRING_HOLDER  [STRING_HOLDER]  4.89,50.29 0 top
VBUS  [1X01']  246.19,42.61 0 top
VR1  B100k  [POT-PTH-ALPS-KIT]  84.58,121.16 270 bottom
VR2  B100k  [POT-PTH-ALPS-KIT]  46.74,121.16 270 bottom
VT1  [1X01]  14.22,55.63 0 top
VT2  [1X01]  21.84,55.63 0 top
VT3  [1X01]  16.76,55.63 0 top
VT4  [1X01]  19.3,55.63 0 top
X1  3P-2MM-TH-MALE  [3P-2MM-TH]  130.51,10.49 180 bottom
X2  NRJ6HF2  [NRJ6HF2]  156.24,5.91 270 top
X3  NRJ6HF2  [NRJ6HF2]  173.8,5.75 270 top
X4  USB+SHIELD  [USB-B-PTH]  183.48,14.22 90 top
X5  332-02  [332-02]  59.88,24.46 90 bottom
X6  332-02  [332-02]  41.85,24.44 90 bottom
X7  332-02  [332-02]  24.07,24.44 90 bottom
X8  332-02  [332-02]  6.03,24.46 90 bottom
X9  3P-2MM-TH-MALE  [3P-2MM-TH]  58.84,9.74 180 bottom
X10  3P-2MM-TH-MALE  [3P-2MM-TH]  40.81,9.74 180 bottom
X11  3P-2MM-TH-MALE  [3P-2MM-TH]  23.03,9.74 180 bottom
X12  3P-2MM-TH-MALE  [3P-2MM-TH]  4.99,9.74 180 bottom
X13  3P-2MM-TH-MALE  [3P-2MM-TH]  299.19,26.75 270 bottom
X14  3P-2MM-TH-MALE  [3P-2MM-TH]  299.11,44.5 270 bottom
X15  3P-2MM-TH-MALE  [3P-2MM-TH]  76.63,10.49 180 bottom
X16  332-02  [332-02]  131.47,25.17 90 bottom
X17  332-02  [332-02]  284.53,25.81 180 top
X18  332-02  [332-02]  284.53,43.59 180 top
X19  332-02  [332-02]  77.62,25.22 90 bottom